# Altium project fangdadianlu.PrjPcb
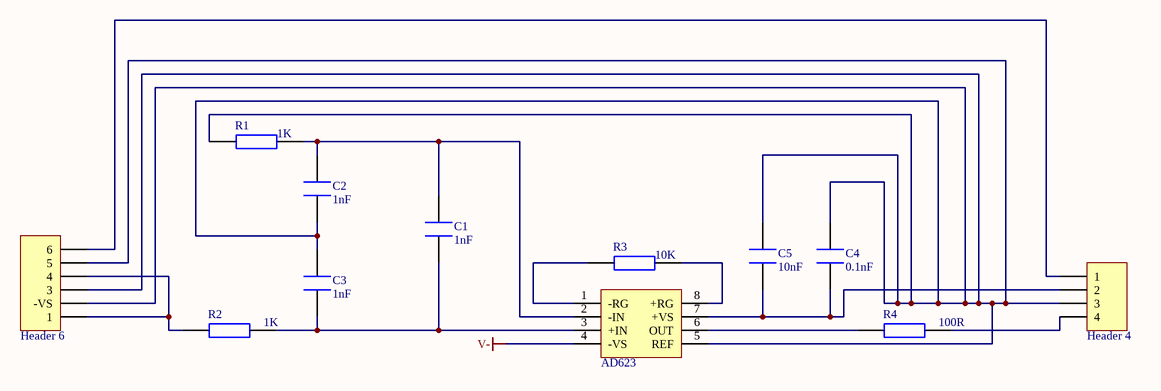
[diagram p0: Sheet2.SchDoc]
1 sheet, 12 parts. Net scope: global (net labels, ports and power ports of the same name join across sheets).
Board file: 光电.PcbDoc

## Sheet Sheet2.SchDoc
size A4; SheetNumber: 1; SheetTotal: 1

### Parts
(Parts that share a designator on the sheet are numbered #1, #2 ... from top to bottom, then left to right.)
?#1  AD623  [SO8_M]
?#2  Header 4  [软排线4p]
?#3  Header 6  [软排线6p]
C1  1nF  [0402]
C2  1nF  [0402]
C3  1nF  [0402]
C4  0.1nF  [0402]
C5  10nF  [0402]
R1  1K  [0402-A]
R2  1K  [0402-A]
R3  10K  [0402-A]
R4  100R  [0402-A]

### Nets
V-: ?#1.4(-VS)
Net?#1_1: ?#1.1(-RG) R3.1
Net?#1_2: ?#1.2(-IN) C1.2 C2.2 R1.2
Net?#1_3: ?#1.3(+IN) C1.1 C3.1 R2.2
Net?#1_5: ?#1.5(REF) ?#2.3 ?#3.3 ?#3.4(-VS) ?#3.5 C2.1 C3.2 C4.2 C5.2 R1.1
Net?#1_6: ?#1.6(OUT) R4.1
Net?#1_7: ?#1.7(+VS) ?#2.2 C4.1 C5.1
Net?#1_8: ?#1.8(+RG) R3.2
Net?#2_1: ?#2.1 ?#3.6
Net?#2_4: ?#2.4 R4.2
Net?#3_1: ?#3.1 ?#3.4 R2.1

### Library data of the parts
?#1 = AD623: IC
?#2 = Header 4: Header, 4-Pin; LatestRevisionDate: 17-Jul-2002; LatestRevisionNote: Re-released for DXP Platform.; Publisher: Altium Limited
?#3 = Header 6: Header, 6-Pin; LatestRevisionDate: 17-Jul-2002; LatestRevisionNote: Re-released for DXP Platform.; Publisher: Altium Limited
C1-C5 = CAP: 电容
R1-R4 = RES: 电阻